# Altium project SSL_Motherboard_2024.PrjPcb
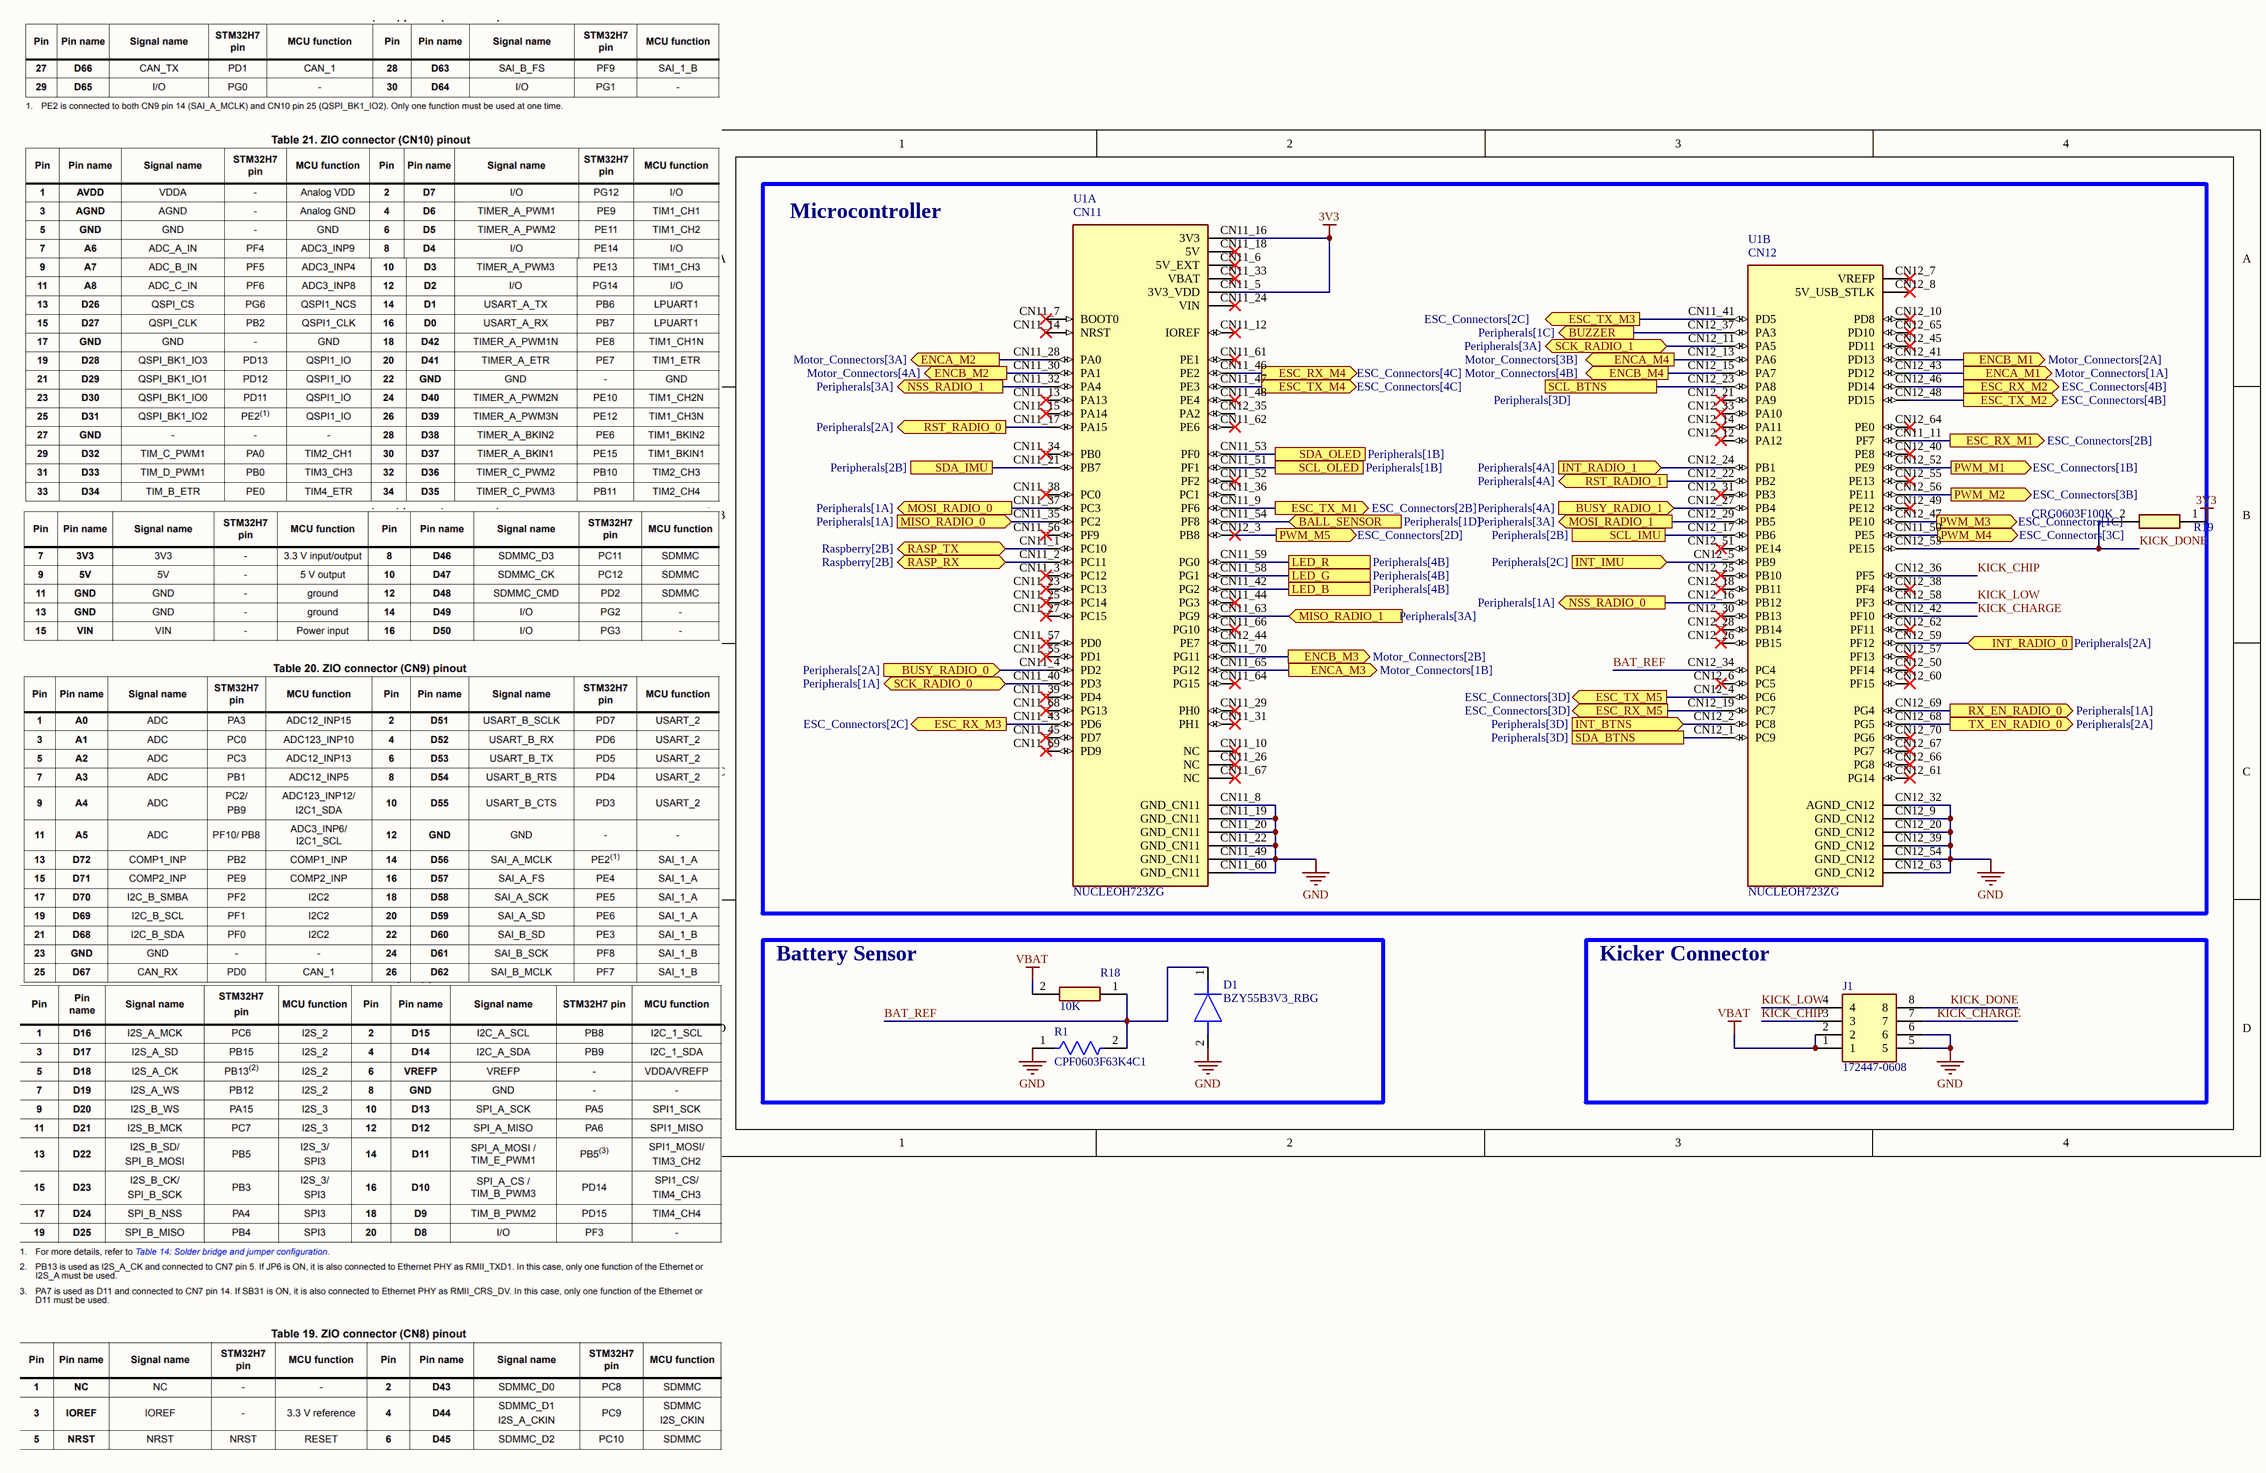
[diagram p0: Main.SchDoc]
6 sheets, 75 parts. Net scope: flat (ports and power ports of the same name join across sheets).
Board file: MotherBoard.PcbDoc
Sheets:
  Main.SchDoc
  PowerSupply.SchDoc
  Peripherals.SchDoc
  Raspberry.SchDoc
  Motor_Connectors.SchDoc
  ESC_Connectors.SchDoc

## Sheet Main.SchDoc
size A4; SheetNumber: 1; SheetTotal: 6

### Parts
D1  BZY55B3V3_RBG  [BZY55B3V3RBG]
J1  172447-0608  [172447-YY08]
R1  CPF0603F63K4C1  [FP-CPF0603-MFG]
R18  10K  [RESC1608X55N]
R19  CRG0603F100K  [RESC1608X55N]
U1  NUCLEOH723ZG  [NEW_NUCLEO]  (parts A,B of 2)

### Blocks framed on the sheet
Microcontroller: R19 U1
Battery Sensor: D1 R1 R18
Kicker Connector: J1

### Ports
BALL_SENSOR (in, see Peripherals[1D]), BUSY_RADIO_0 (in, see Peripherals[2A]), BUSY_RADIO_1 (in, see Peripherals[4A]), BUZZER (out, see Peripherals[1C]), ENCA_M1 (out, see Motor_Connectors[1A]), ENCA_M2 (out, see Motor_Connectors[3A]), ENCA_M3 (out, see Motor_Connectors[1B]), ENCA_M4 (out, see Motor_Connectors[3B]), ENCB_M1 (out, see Motor_Connectors[2A]), ENCB_M2 (out, see Motor_Connectors[4A]), ENCB_M3 (out, see Motor_Connectors[2B]), ENCB_M4 (out, see Motor_Connectors[4B]), ESC_RX_M1 (out, see ESC_Connectors[2B]), ESC_RX_M2 (out, see ESC_Connectors[4B]), ESC_RX_M3 (out, see ESC_Connectors[2C]), ESC_RX_M4 (out, see ESC_Connectors[4C]), ESC_RX_M5 (out, see ESC_Connectors[3D]), ESC_TX_M1 (out, see ESC_Connectors[2B]), ESC_TX_M2 (out, see ESC_Connectors[4B]), ESC_TX_M3 (out, see ESC_Connectors[2C]), ESC_TX_M4 (out, see ESC_Connectors[4C]), ESC_TX_M5 (out, see ESC_Connectors[3D]), INT_BTNS (in, see Peripherals[3D]), INT_IMU (in, see Peripherals[2C]), INT_RADIO_0 (in, see Peripherals[2A]), INT_RADIO_1 (in, see Peripherals[4A]), LED_B (see Peripherals[4B]), LED_G (see Peripherals[4B]), LED_R (see Peripherals[4B]), MISO_RADIO_0 (in, see Peripherals[1A]), MISO_RADIO_1 (in, see Peripherals[3A]), MOSI_RADIO_0 (out, see Peripherals[1A]), MOSI_RADIO_1 (out, see Peripherals[3A]), NSS_RADIO_0 (out, see Peripherals[1A]), NSS_RADIO_1 (out, see Peripherals[3A]), PWM_M1 (out, see ESC_Connectors[1B]), PWM_M2 (out, see ESC_Connectors[3B]), PWM_M3 (out, see ESC_Connectors[1C]), PWM_M4 (out, see ESC_Connectors[3C]), PWM_M5 (out, see ESC_Connectors[2D]), RASP_RX (bidir, see Raspberry[2B]), RASP_TX (bidir, see Raspberry[2B]), RST_RADIO_0 (out, see Peripherals[2A]), RST_RADIO_1 (out, see Peripherals[4A]), RX_EN_RADIO_0 (out, see Peripherals[1A]), SCK_RADIO_0 (bidir, see Peripherals[1A]), SCK_RADIO_1 (bidir, see Peripherals[3A]), SCL_BTNS (see Peripherals[3D]), SCL_IMU (see Peripherals[2B]), SCL_OLED (see Peripherals[1B]), SDA_BTNS (see Peripherals[3D]), SDA_IMU (see Peripherals[2B]), SDA_OLED (see Peripherals[1B]), TX_EN_RADIO_0 (out, see Peripherals[2A])

### Nets
3V3: R19.1 U1.CN11_5(3V3_VDD) U1.CN11_16(3V3)
GND: D1.2(A) J1.5 J1.6 R1.1 U1.CN11_8(GND_CN11) U1.CN11_19(GND_CN11) U1.CN11_20(GND_CN11) U1.CN11_22(GND_CN11) U1.CN11_49(GND_CN11) U1.CN11_60(GND_CN11) U1.CN12_9(GND_CN12) U1.CN12_20(GND_CN12) U1.CN12_32(AGND_CN12) U1.CN12_39(GND_CN12) U1.CN12_54(GND_CN12) U1.CN12_63(GND_CN12)
VBAT: J1.1 J1.2 R18.2
BAT_REF: D1.1(K) R1.2 R18.1 U1.CN12_34(PC4)
KICK_CHARGE: J1.7 U1.CN12_42(PF10)
KICK_CHIP: J1.3 U1.CN12_36(PF5)
KICK_DONE: J1.8 R19.2 U1.CN12_53(PE15)
KICK_LOW: J1.4 U1.CN12_58(PF3)
NetIC3_4: U1.CN12_5(PB9) ; port INT_IMU
NetIC3_13: U1.CN12_17(PB6) ; port SCL_IMU
NetIC3_14: U1.CN11_21(PB7) ; port SDA_IMU
NetIC4_1: U1.CN12_2(PC8) ; port INT_BTNS
NetIC4_2: U1.CN12_23(PA8) ; port SCL_BTNS
NetIC4_4: U1.CN12_1(PC9) ; port SDA_BTNS
NetJ2_2: U1.CN11_54(PF8) ; port BALL_SENSOR
NetJ4_32: U1.CN11_2(PC11) ; port RASP_RX
NetJ4_34: U1.CN11_1(PC10) ; port RASP_TX
NetJ6_2: U1.CN12_41(PD13) ; port ENCB_M1
NetJ6_7: U1.CN12_43(PD12) ; port ENCA_M1
NetJ7_2: U1.CN11_70(PG11) ; port ENCB_M3
NetJ7_7: U1.CN11_65(PG12) ; port ENCA_M3
NetJ8_2: U1.CN11_30(PA1) ; port ENCB_M2
NetJ8_7: U1.CN11_28(PA0) ; port ENCA_M2
NetJ10_2: U1.CN12_15(PA7) ; port ENCB_M4
NetJ10_7: U1.CN12_13(PA6) ; port ENCA_M4
NetJ16_01: U1.CN12_52(PE9) ; port PWM_M1
NetJ16_02: U1.CN11_9(PF6) ; port ESC_TX_M1
NetJ16_04: U1.CN11_11(PF7) ; port ESC_RX_M1
NetJ17_01: U1.CN12_47(PE10) ; port PWM_M3
NetJ17_02: U1.CN11_41(PD5) ; port ESC_TX_M3
NetJ17_04: U1.CN11_43(PD6) ; port ESC_RX_M3
NetJ19_01: U1.CN12_3(PB8) ; port PWM_M5
NetJ19_02: U1.CN12_4(PC6) ; port ESC_TX_M5
NetJ19_04: U1.CN12_19(PC7) ; port ESC_RX_M5
NetJ22_01: U1.CN12_56(PE11) ; port PWM_M2
NetJ22_02: U1.CN12_48(PD15) ; port ESC_TX_M2
NetJ22_04: U1.CN12_46(PD14) ; port ESC_RX_M2
NetJ23_01: U1.CN11_50(PE5) ; port PWM_M4
NetJ23_02: U1.CN11_47(PE3) ; port ESC_TX_M4
NetJ23_04: U1.CN11_46(PE2) ; port ESC_RX_M4
NetMD1_3: U1.CN11_35(PC2) ; port MISO_RADIO_0
NetMD1_4: U1.CN11_37(PC3) ; port MOSI_RADIO_0
NetMD1_5: U1.CN11_40(PD3) ; port SCK_RADIO_0
NetMD1_6: U1.CN12_16(PB12) ; port NSS_RADIO_0
NetMD1_8: U1.CN12_69(PG4) ; port RX_EN_RADIO_0
NetMD1_9: U1.CN12_68(PG5) ; port TX_EN_RADIO_0
NetMD1_11: U1.CN11_17(PA15) ; port RST_RADIO_0
NetMD1_12: U1.CN11_4(PD2) ; port BUSY_RADIO_0
NetMD1_13: U1.CN12_59(PF12) ; port INT_RADIO_0
NetMD2_3: U1.CN11_63(PG9) ; port MISO_RADIO_1
NetMD2_4: U1.CN12_29(PB5) ; port MOSI_RADIO_1
NetMD2_5: U1.CN12_11(PA5) ; port SCK_RADIO_1
NetMD2_6: U1.CN11_32(PA4) ; port NSS_RADIO_1
NetMD2_11: U1.CN12_22(PB2) ; port RST_RADIO_1
NetMD2_12: U1.CN12_27(PB4) ; port BUSY_RADIO_1
NetMD2_13: U1.CN12_24(PB1) ; port INT_RADIO_1
NetP1_3: U1.CN11_51(PF1) ; port SCL_OLED
NetP1_4: U1.CN11_53(PF0) ; port SDA_OLED
NetR10_1: U1.CN12_37(PA3) ; port BUZZER
NetR21_2: U1.CN11_42(PG2) ; port LED_B
NetR22_2: U1.CN11_59(PG0) ; port LED_R
NetR23_2: U1.CN11_58(PG1) ; port LED_G

Not connected (* = marked no-connect by the designer): U1 CN11_3(PC12)* CN11_6(5V_EXT)* CN11_7(BOOT0)* CN11_10(NC)* CN11_12(IOREF)* CN11_13(PA13)* CN11_14(NRST)* CN11_15(PA14)* CN11_18(5V)* CN11_23(PC13)* CN11_24(VIN)* CN11_25(PC14)* CN11_26(NC)* CN11_27(PC15)* CN11_29(PH0)* CN11_31(PH1)* CN11_33(VBAT)* CN11_34(PB0)* CN11_36(PC1) CN11_38(PC0)* CN11_39(PD4)* CN11_44(PG3)* CN11_45(PD7)* CN11_48(PE4)* CN11_52(PF2)* CN11_55(PD1)* CN11_56(PF9)* CN11_57(PD0)* CN11_61(PE1)* CN11_62(PE6)* CN11_64(PG15)* CN11_66(PG10)* CN11_67(NC)* CN11_68(PG13)* CN11_69(PD9)* CN12_6(PC5)* CN12_7(VREFP)* CN12_8(5V_USB_STLK)* CN12_10(PD8)* CN12_12(PA12)* CN12_14(PA11)* CN12_18(PB11)* CN12_21(PA9)* CN12_25(PB10)* CN12_26(PB15)* CN12_28(PB14)* CN12_30(PB13)* CN12_31(PB3)* CN12_33(PA10)* CN12_35(PA2) CN12_38(PF4)* CN12_40(PE8)* CN12_44(PE7) CN12_45(PD11)* CN12_49(PE12)* CN12_50(PF14)* CN12_51(PE14)* CN12_55(PE13)* CN12_57(PF13)* CN12_60(PF15)* CN12_61(PG14)* CN12_62(PF11)* CN12_64(PE0)* CN12_65(PD10)* CN12_66(PG8)* CN12_67(PG7)* CN12_70(PG6)*

### Notes on the sheet
- (in symbol NUCLEOH723ZG, part A) CN11
- (in symbol NUCLEOH723ZG, part B) CN12

### Library data of the parts
D1 = BZY55B3V3_RBG: Diode; Manufacturer_Name: Taiwan Semiconductor; Manufacturer_Part_Number: BZY55B3V3 RBG; Datasheet Link: https://componentsearchengine.com/Datasheets/1/BZY55B3V3 RBG.pdf; Height: 0.85mm; Mouser Part Number: 821-BZY55B3V3RBG; Mouser Price/Stock: https://www.mouser.co.uk/ProductDetail/Taiwan-Semiconductor/BZY55B3V3-RBG?qs=mAH9sUMRCtvrJdI%2FtfeTug%3D%3D
J1 = 172447-0608: Connector; Manufacturer_Name: Molex; Datasheet Link: https://www.molex.com/pdm_docs/sd/1724470406_sd.pdf; Height: 12.8mm; Manufacturer_Part_Number: 172447-0608; Mouser Part Number: 538-172447-0608; Mouser Price/Stock: https://www.mouser.co.uk/ProductDetail/Molex/172447-0608?qs=t7xnP681wgUaroQMnMhOkA%3D%3D
R1 = CMP-03211-001472-1: RES SMD 63.4KΩ 1% 1/16W 0603; Manufacturer: TE Connectivity; Voltage Rating: 50V; Temperature Coefficient: 50ppm/°C; Power Rating: 0.063W; Composition: Thin Film; Octopart: https://octopart.com/cpf0603f63k4c1-te+connectivity-7515022; Temperature Range High: +155°C; Lead Free: Yes; Series: CPF; Resistance: 63.4KΩ; Height: 0.55mm; Package: CPF0603; Manufacturer Part Number: CPF0603F63K4C1; Temperature: -55°C to +155°C; Device Class L3: Chip SMD Resistors; Ipc Land Pattern Name: RESC15580X45; RoHS: TRUE; Category: Res; ComponentLink2URL: https://www.te.com/commerce/DocumentDelivery/DDEController?Action=showdoc&DocId=Data+Sheet%7F1773200%7FM%7Fpdf%7FEnglish%7FENG_DS_1773200_M.pdf%7F3-1676481-2; Value: 63.4KΩ; packaging: 1k Reel; Tolerance: 1%; Automotive: No; Device Class L2: Resistors; Device Class L1: Passive Components; Temperature Range Low: -55°C; ComponentLink2Description: Datasheet; octopart_url: https://octopart.com/cpf0603f63k4c1-te+connectivity-7515022
R18 = ERJ-U3RD1002V: Resistor; Manufacturer_Name: Panasonic; Datasheet Link: https://industrial.panasonic.com/cdbs/www-data/pdf/RDP0000/RDP0000C343.pdf; Height: 0.55mm; Manufacturer_Part_Number: ERJ-U3RD1002V; Mouser Part Number: 667-ERJ-U3RD1002V; Mouser Price/Stock: https://www.mouser.co.uk/ProductDetail/Panasonic/ERJ-U3RD1002V?qs=TiOZkKH1s2Rg0qUjKdWcPw%3D%3D; Arrow Part Number: ERJ-U3RD1002V; Arrow Price/Stock: https://www.arrow.com/en/products/erj-u3rd1002v/panasonic?region=nac
R19 = CRG0603F100K: Resistor; Manufacturer_Name: TE Connectivity; Datasheet Link: http://docs-europe.electrocomponents.com/webdocs/13d1/0900766b813d116f.pdf; Height: 0.55mm; Manufacturer_Part_Number: CRG0603F100K; Mouser Part Number: 279-CRG0603F100K; Mouser Price/Stock: https://www.mouser.co.uk/ProductDetail/TE-Connectivity-Holsworthy/CRG0603F100K?qs=VHcS2MTj4gaG9fI5w0o7FA%3D%3D; Arrow Part Number: CRG0603F100K; Arrow Price/Stock: https://www.arrow.com/en/products/crg0603f100k/te-connectivity?region=nac
U1 = NUCLEOH723ZG: STM32H723ZG Nucleo-144 STM32H7 STM32 MCU 32-Bit Embedded Evaluation Board; MF: STMicroelectronics; Value: *; Purchase-URL: https://pricing.snapeda.com/search/part/NUCLEOH723ZG/?ref=eda; Package: None; Check_prices: https://www.snapeda.com/parts/NUCLEOH723ZG/STMicroelectronics/view-part/?ref=eda; MP: NUCLEOH723ZG; Price: None; SnapEDA_Link: https://www.snapeda.com/parts/NUCLEOH723ZG/STMicroelectronics/view-part/?ref=snap; Availability: In Stock

## Sheet PowerSupply.SchDoc
size A4; SheetNumber: 2; SheetTotal: 6
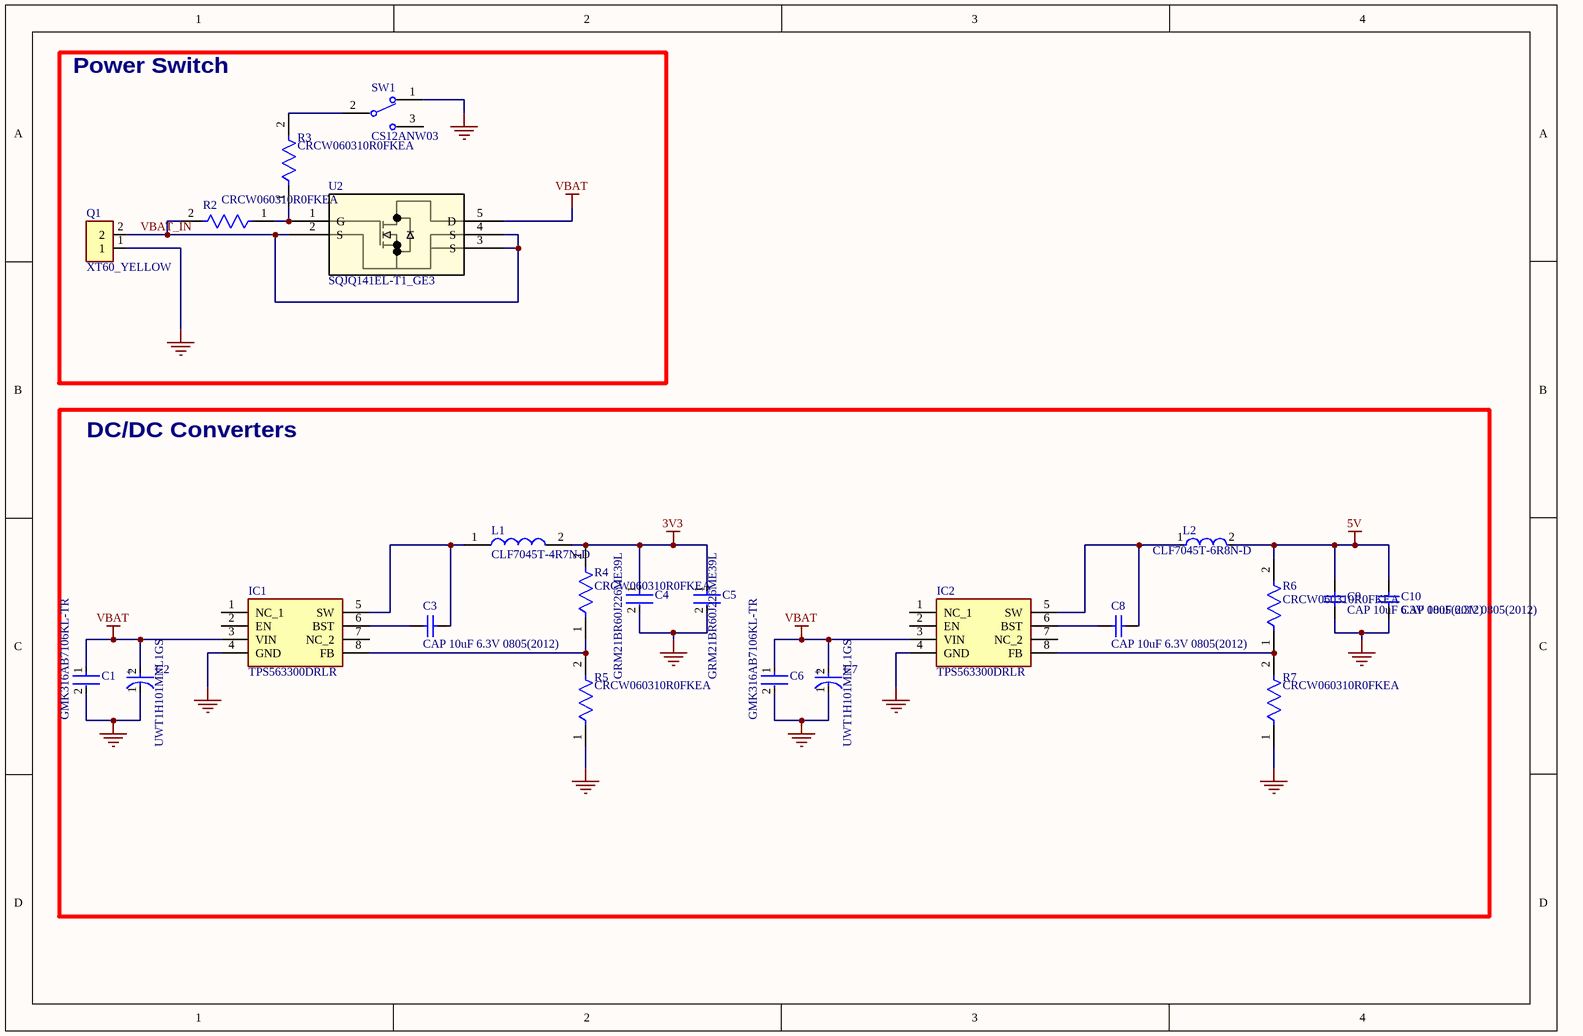
[diagram p1: PowerSupply.SchDoc]

### Parts
C1  GMK316AB7106KL-TR  [FP-1206-L_3_2_0_2-W_1_6_0-IPC_C]
C2  UWT1H101MNL1GS  [FP-UWT1H101MNL1GS-MFG]
C3  CAP 10uF 6.3V 0805(2012)  [CAPC0805(2012)155_L]
C4  GRM21BR60J226ME39L  [FP-GRM21B-0_15-MFG]
C5  GRM21BR60J226ME39L  [FP-GRM21B-0_15-MFG]
C6  GMK316AB7106KL-TR  [FP-1206-L_3_2_0_2-W_1_6_0-IPC_C]
C7  UWT1H101MNL1GS  [FP-UWT1H101MNL1GS-MFG]
C8  CAP 10uF 6.3V 0805(2012)  [CAPC0805(2012)155_L]
C9  CAP 10uF 6.3V 0805(2012)  [CAPC0805(2012)155_L]
C10  CAP 10uF 6.3V 0805(2012)  [CAPC0805(2012)155_L]
IC1  TPS563300DRLR  [SOTFL50P160X60-8N]
IC2  TPS563300DRLR  [SOTFL50P160X60-8N]
L1  CLF7045T-4R7N-D  [CLF7045-D]
L2  CLF7045T-6R8N-D  [FP-CLF7045-MFG]
Q1  XT60_YELLOW  [AMASS_XT60PB-M]
R2  CRCW060310R0FKEA  [FP-CRCW0603-e3-IPC_A]
R3  CRCW060310R0FKEA  [FP-CRCW0603-e3-IPC_A]
R4  CRCW060310R0FKEA  [FP-CRCW0603-e3-IPC_A]
R5  CRCW060310R0FKEA  [FP-CRCW0603-e3-IPC_A]
R6  CRCW060310R0FKEA  [FP-CRCW0603-e3-IPC_A]
R7  CRCW060310R0FKEA  [FP-CRCW0603-e3-IPC_A]
SW1  CS12ANW03  [FP-CS12ANW03-MFG]
U2  SQJQ141EL-T1_GE3  [PowerPAK_8x8L_BWL-2_VIS]

### Blocks framed on the sheet
Power Switch: Q1 R2 R3 SW1 U2
DC/DC Converters: C1-C10 IC1 IC2 L1 L2 R4-R7

### Nets
3V3: C4.1 C5.1 L1.2 R4.2
5V: C9.2 C10.2 L2.2 R6.2
GND: C1.2 C2.1(C) C4.2 C5.2 C6.2 C7.1(C) C9.1 C10.1 IC1.4(GND) IC2.4(GND) Q1.1 R5.1 R7.1 SW1.1
VBAT: C1.1 C2.2(A) C6.1 C7.2(A) IC1.3(VIN) IC2.3(VIN) U2.5(D)
VBAT_IN: Q1.2 R2.2 U2.2(S) U2.3(S) U2.4(S)
NetC3_1: C3.1 IC1.5(SW) L1.1
NetC3_2: C3.2 IC1.6(BST)
NetC8_1: C8.1 IC2.5(SW) L2.1
NetC8_2: C8.2 IC2.6(BST)
NetIC1_8: IC1.8(FB) R4.1 R5.2
NetIC2_8: IC2.8(FB) R6.1 R7.2
NetR2_1: R2.1 R3.1 U2.1(G)
NetR3_2: R3.2 SW1.2(2(COM))

Not connected (* = marked no-connect by the designer): IC1 1(NC_1) 2(EN) 7(NC_2); IC2 1(NC_1) 2(EN) 7(NC_2); SW1 3

### Notes on the sheet
- (in symbol CMP-2000-07373-2) +

### Library data of the parts
C1 C6 = CMP-2000-06324-3: None; Voltage Rating (DC): 35V; Capacitance: 10uF; Tolerance: 10%; Dielectric: X7R; Thickness: 0.071inch; Mount: Surface Mount; Case Code (Imperial): 1206; RoHS Compliant: Yes; Voltage Rating: 35V; Case Code (Metric): 3216; Height: 1.6mm; Packaging: Tape and Reel; Resistor Type: Ceramic; REACH SVHC: No SVHC; Max Operating Temperature: 125°C; Termination: SMD/SMT; Package Quantity: 2000; Width: 1.6mm; Case/Package: 1206; Length: 0.126inch; Series: M; Min Operating Temperature: -55°C
C2 C7 = CMP-2000-07373-2: CAP ALUM 100UF 20% 50V SMD; Leakage Current: 3uA; Ripple Current: 140mA; Life (Hours): 1000Hour; Dissipation Factor: 0.14%; Dielectric Material: Aluminium; Termination: SMD/SMT; Tolerance: 20%; Package Quantity: 500; Capacitance: 100uF; Height: 10mm; REACH SVHC: No SVHC; Case/Package: Radial; Series: WT; Diameter: 8mm; Voltage Rating: 50V; Construction: Cylindrical; Length: 10mm; Min Operating Temperature: -55°C; Max Operating Temperature: 105°C; Voltage Rating (DC): 50V; Packaging: Tape and Reel; Voltage: 50V; Mount: Surface Mount; Ripple Current (AC): 140mA; Radiation Hardening: No; Number of Pins: 2; Lead Free: Lead Free; Height - Seated (Max): 0.413inch; RoHS Compliant: Yes
C3 C8-C10 = CMP-1036-04916-1: CAP 10uF 6.3V ±10% 0805 (2012 Metric) Thickness 1.55mm SMD; Tolerance: Â±10%; Case-Metric: 2012; Case-EIA: 0805; Rated Voltage: 6.3 V; Technology: SMT; Value: 10uF; Max Thickness: 1.55 mm
C4 C5 = CMP-2007-03385-2: Chip Multilayer Ceramic Capacitors for General Purpose, 0805, 22uF, X5R, 15%, 20%, 6.3V; Material: Ceramic; Max Operating Temperature: 85°C; Voltage: 6.3V; Min Operating Temperature: -55°C; Case/Package: 0805; Thickness: 0.053inch; Dielectric: X5R; Packaging: Tape and Reel; Depth: 1.25mm; Termination: SMD/SMT; Voltage Rating (DC): 6.3V; Radiation Hardening: No; Tolerance: 20%; Mount: Surface Mount; Lead Free: Lead Free; Package Quantity: 1; REACH SVHC: No SVHC; Voltage Rating: 6.3V; Capacitance: 22uF; Length: 2mm; Case Code (Imperial): 0805; Case Code (Metric): 2012; Width: 0.049inch; Height: 1.25mm
IC1 IC2 = TPS563300DRLR: Integrated Circuit; Manufacturer_Name: Texas Instruments; Datasheet Link: https://www.ti.com/lit/ds/symlink/tps563300.pdf?ts=1666035990155&ref_url=https%253A%252F%252Fwww.ti.com%252Fproduct%252FTPS563300; Height: 0.6mm; Manufacturer_Part_Number: TPS563300DRLR; Mouser Part Number: 595-TPS563300DRLR; Mouser Price/Stock: https://www.mouser.co.uk/ProductDetail/Texas-Instruments/TPS563300DRLR?qs=vvQtp7zwQdMDxJAw0dSlAg%3D%3D
L1 = CLF7045T-4R7N-D: Inductor; Manufacturer_Name: TDK; Datasheet Link: https://product.tdk.com/system/files/dam/doc/product/inductor/inductor/smd/wdcatalog/withdrawn_inductor_commercial_power_clf7045_en.pdf; Height: 4.8mm; Manufacturer_Part_Number: CLF7045T-4R7N-D; Mouser Part Number: 810-CLF7045T-4R7N-D; Mouser Price/Stock: https://www.mouser.co.uk/ProductDetail/TDK/CLF7045T-4R7N-D?qs=ilIqL0%2F%2FoDU8gjMEHwFGUQ%3D%3D; Arrow Part Number: CLF7045T-4R7N-D; Arrow Price/Stock: https://www.arrow.com/en/products/clf7045t-4r7n-d/tdk
L2 = CMP-08253-000023-1: FIXED IND 6.8UH 3A 27 MOHM SMD; Manufacturer: TDK; Test Frequency: 100kHz; Tolerance: 30%; Core Material: Ferrite; Automotive Grade: Grade 0; Shielding: true; Series Resistance: 35.1mΩ; ComponentLink2Description: Datasheet; Inductance: 6.8uH; Lead Free: Yes; Device Class L3: Fixed Inductors; Rms Current: 3A; Package: CLF7045; Manufacturer Part Number: CLF7045T-6R8N-D; Digikey Description: FIXED IND 6.8UH 3A 27 MOHM SMD; Temperature Range Low: -40°C; ComponentLink2URL: https://product.tdk.com/en/search/inductor/inductor/smd/info/print_pdf; Temperature Range High: +150°C; Device Class L1: Passive Components; Device Class L2: Inductors; Composition: Wirewound; Height: 4.8mm; RoHS: TRUE; Mouser Description: Inductor Power Shielded Wirewound 6.8uH 30% 100KHz Ferrite 3A 35.1mOhm DCR Automotive T/R; Value: 6.8uH; Octopart: https://octopart.com/clf7045t-6r8n-d-tdk-27590387; Temperature: -40°C to +150°C; Automotive: Yes; Category: Ind
Q1 = XT60_YELLOW: Power connector; 65A; PIN: 2; Colour: yellow; MP: XT60 YELLOW; MF: Pololu; SnapEDA_Link: https://www.snapeda.com/parts/XT60%20YELLOW/Pololu/view-part/?ref=snap; Availability: Not in stock; Package: None; Check_prices: https://www.snapeda.com/parts/XT60%20YELLOW/Pololu/view-part/?ref=eda; Value: *; Price: None
R2-R7 = CMP-2000-03845-2: RES Thick Film, 10Ω, 1%, 0.1W, 100ppm/°C, 0603; Resistance: 10R; Voltage Rating (DC): 75V; Power Rating: 100mW; Depth: 0.85mm; Height: 0.45mm; Package Quantity: 10; Temperature Coefficient: 100ppm/°C; Weight: 7.1E-05oz; Case Code (Metric): 1608; Number of Terminations: 2; Features: Automotive AEC-Q200; Termination: SMD/SMT; Lead Free: Lead Free; Mount: Surface Mount; Number of Pins: 2; Tolerance: 1%; Max Power Dissipation: 100mW; Width: 0.033inch; Contact Plating: Tin; Case Code (Imperial): 0603; Max Operating Temperature: 155°C; Min Operating Temperature: -55°C; Voltage Rating: 75V; Length: 1.55mm; Case/Package: 0603; Composition: Thick Film; Packaging: Tape and Reel; Military Standard: Not
SW1 = CMP-31746-000002-1: SWITCH SLIDE SPDT 3A 125V; Max Voltage Rating (AC): 250V; Mechanical Life: 50000Cycles; Switch Travel: 2.2mm; Electrical Life: 20000Cycles; Actuator Length: 5.1mm; Illumination Type: Non-Illuminated; Contact Style: Non-Shorting; Actuator Type: Standard; Actuator Material: Nylon; Switch Function: On-On; Max Operating Temperature: 85°C; Series: CS; Contact Current Rating: 3A; Min Operating Temperature: -30°C; Current Rating: 3A; Mount: Through Hole; Depth: 7.5mm; RoHS Compliant: Yes; Throw Configuration: SPDT; Lead Free: Lead Free; Orientation: Vertical; Contact Plating: Silver; Reach SVHC Compliant: Yes; Termination: PC Pin; Max Current Rating: 3A; Packaging: Tray; Length: 14mm; Package Quantity: 1; Primary Type: SWITCH; Flammability Rating: UL94 V-0; Contact Material: Copper; Voltage Rating (AC): 125V
U2 = SQJQ141EL-T1_GE3: No Description Available; Mfr_Name: Vishay; Copyright: Copyright (C) 2023 Ultra Librarian. All rights reserved.; Manufacturer_Part_Number: SQJQ141EL-T1_GE3; RefDes: RefDes; Type: DEV

## Sheet Peripherals.SchDoc
size A4; SheetNumber: 3; SheetTotal: 6
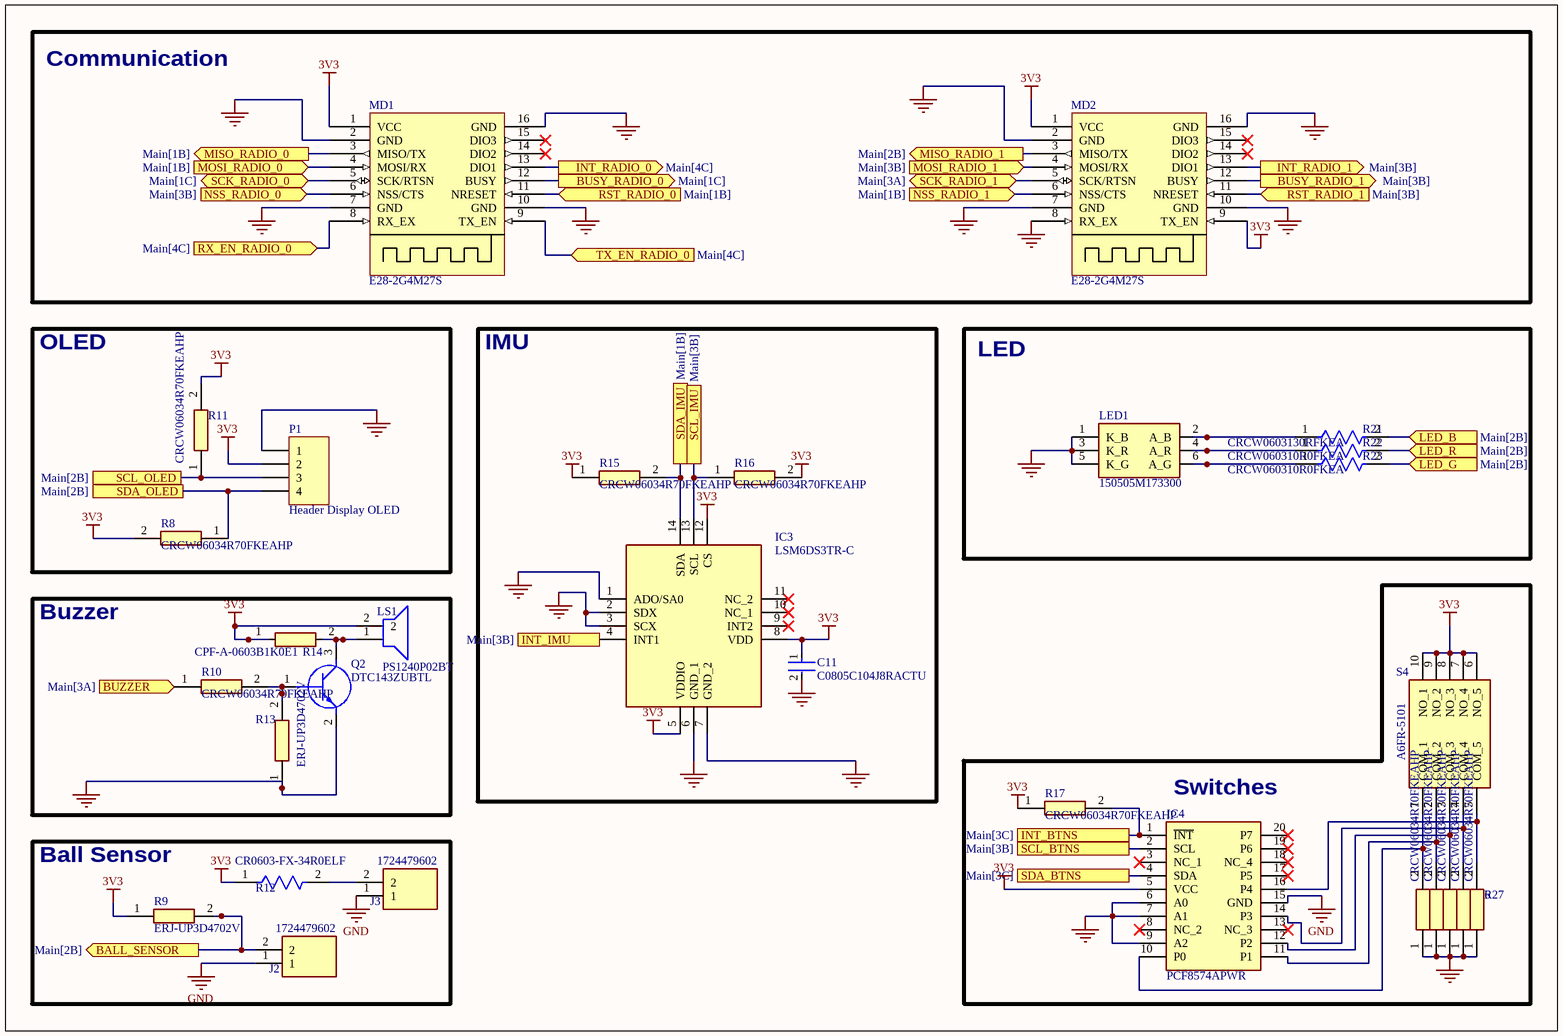
[diagram p2: Peripherals.SchDoc]

### Parts
C11  C0805C104J8RACTU  [FP-C0805C-DN-MFG]
IC3  LSM6DS3TR-C  [LGA-14(2.5X3X0.86)]
IC4  PCF8574APWR  [SOP65P640X120-20N]
J2  1724479602  [172447_94959697_02]
J3  1724479602  [172447_94959697_02]
LED1  150505M173300  [150505M173300]
LS1  PS1240P02BT  [PS1240P02BT]
MD1  E28-2G4M27S  [E28-2G4M27S]
MD2  E28-2G4M27S  [E28-2G4M27S]
P1  Header Display OLED  [OLED]
Q2  DTC143ZUBTL  [SOTFL65P210X105-3N]
R8  CRCW06034R70FKEAHP  [RESC1608X55N]
R9  ERJ-UP3D4702V  [ERJUP3]
R10  CRCW06034R70FKEAHP  [RESC1608X55N]
R11  CRCW06034R70FKEAHP  [RESC1608X55N]
R12  CR0603-FX-34R0ELF  [FP-CR0603-MFG]
R13  ERJ-UP3D4702V  [ERJUP3]
R14  CPF-A-0603B1K0E1  [RESC1608X55N]
R15  CRCW06034R70FKEAHP  [RESC1608X55N]
R16  CRCW06034R70FKEAHP  [RESC1608X55N]
R17  CRCW06034R70FKEAHP  [RESC1608X55N]
R20  CRCW06034R70FKEAHP  [RESC1608X55N]
R21  CRCW0603130RFKEA  [FP-CRCW0603-e3-IPC_A]
R22  CRCW060310R0FKEA  [FP-CRCW0603-e3-IPC_A]
R23  CRCW060310R0FKEA  [FP-CRCW0603-e3-IPC_A]
R24  CRCW06034R70FKEAHP  [RESC1608X55N]
R25  CRCW06034R70FKEAHP  [RESC1608X55N]
R26  CRCW06034R70FKEAHP  [RESC1608X55N]
R27  CRCW06034R70FKEAHP  [RESC1608X55N]
S4  A6FR-5101  [A6FR5101]

### Blocks framed on the sheet
Communication: MD1 MD2
OLED: P1 R8 R11
IMU: C11 IC3 R15 R16
LED: LED1 R21-R23
Buzzer: LS1 Q2 R10 R13 R14
Switches: IC4 R17 R20 R24-R27 S4
Ball Sensor: J2 J3 R9 R12

### Ports
BALL_SENSOR (out, see Main[2B]), BUSY_RADIO_0 (out, see Main[1C]), BUSY_RADIO_1 (out, see Main[3B]), BUZZER (in, see Main[3A]), INT_BTNS (see Main[3C]), INT_IMU (out, see Main[3B]), INT_RADIO_0 (out, see Main[4C]), INT_RADIO_1 (out, see Main[3B]), LED_B (in, see Main[2B]), LED_G (in, see Main[2B]), LED_R (in, see Main[2B]), MISO_RADIO_0 (out, see Main[1B]), MISO_RADIO_1 (out, see Main[2B]), MOSI_RADIO_0 (in, see Main[1B]), MOSI_RADIO_1 (in, see Main[3B]), NSS_RADIO_0 (in, see Main[3B]), NSS_RADIO_1 (in, see Main[1B]), RST_RADIO_0 (in, see Main[1B]), RST_RADIO_1 (in, see Main[3B]), RX_EN_RADIO_0 (in, see Main[4C]), SCK_RADIO_0 (bidir, see Main[1C]), SCK_RADIO_1 (bidir, see Main[3A]), SCL_BTNS (see Main[3B]), SCL_IMU (see Main[3B]), SCL_OLED (see Main[2B]), SDA_BTNS (see Main[3C]), SDA_IMU (see Main[1B]), SDA_OLED (see Main[2B]), TX_EN_RADIO_0 (in, see Main[4C])

### Nets
3V3: C11.1 IC3.5(VDDIO) IC3.8(VDD) IC3.12(CS) IC4.5(VCC) LS1.2 MD1.1(VCC) MD2.1(VCC) MD2.9(TX_EN) P1.2 R8.2 R9.1 R11.2 R12.1 R14.1 R15.1 R16.2 R17.1 S4.6(NO_5) S4.7(NO_4) S4.8(NO_3) S4.9(NO_2) S4.10(NO_1)
GND: C11.2 IC3.1(ADO/SA0) IC3.2(SDX) IC3.3(SCX) IC3.6(GND_1) IC3.7(GND_2) IC4.6(A0) IC4.7(A1) IC4.9(A2) IC4.15(GND) J2.1 J3.1 LED1.1(K_B) LED1.3(K_R) LED1.5(K_G) MD1.2(GND) MD1.7(GND) MD1.10(GND) MD1.16(GND) MD2.2(GND) MD2.7(GND) MD2.8(RX_EX) MD2.10(GND) MD2.16(GND) P1.1 Q2.2(E) R13.1 R20.1 R24.1 R25.1 R26.1 R27.1
NetIC3_4: IC3.4(INT1) ; port INT_IMU
NetIC3_13: IC3.13(SCL) R16.1 ; port SCL_IMU
NetIC3_14: IC3.14(SDA) R15.2 ; port SDA_IMU
NetIC4_1: IC4.1(~{INT}) R17.2 ; port INT_BTNS
NetIC4_2: IC4.2(SCL) ; port SCL_BTNS
NetIC4_4: IC4.4(SDA) ; port SDA_BTNS
NetIC4_10: IC4.10(P0) R20.2 S4.1(COM_1)
NetIC4_11: IC4.11(P1) R24.2 S4.2(COM_2)
NetIC4_12: IC4.12(P2) R25.2 S4.3(COM_3)
NetIC4_14: IC4.14(P3) R26.2 S4.4(COM_4)
NetIC4_16: IC4.16(P4) R27.2 S4.5(COM_5)
NetJ2_2: J2.2 R9.2 ; port BALL_SENSOR
NetJ3_2: J3.2 R12.2
NetLED1_2: LED1.2(A_B) R21.1
NetLED1_4: LED1.4(A_R) R22.1
NetLED1_6: LED1.6(A_G) R23.1
NetLS1_1: LS1.1 Q2.3(C) R14.2
NetMD1_3: MD1.3(MISO/TX) ; port MISO_RADIO_0
NetMD1_4: MD1.4(MOSI/RX) ; port MOSI_RADIO_0
NetMD1_5: MD1.5(SCK/RTSN) ; port SCK_RADIO_0
NetMD1_6: MD1.6(NSS/CTS) ; port NSS_RADIO_0
NetMD1_8: MD1.8(RX_EX) ; port RX_EN_RADIO_0
NetMD1_9: MD1.9(TX_EN) ; port TX_EN_RADIO_0
NetMD1_11: MD1.11(NRESET) ; port RST_RADIO_0
NetMD1_12: MD1.12(BUSY) ; port BUSY_RADIO_0
NetMD1_13: MD1.13(DIO1) ; port INT_RADIO_0
NetMD2_3: MD2.3(MISO/TX) ; port MISO_RADIO_1
NetMD2_4: MD2.4(MOSI/RX) ; port MOSI_RADIO_1
NetMD2_5: MD2.5(SCK/RTSN) ; port SCK_RADIO_1
NetMD2_6: MD2.6(NSS/CTS) ; port NSS_RADIO_1
NetMD2_11: MD2.11(NRESET) ; port RST_RADIO_1
NetMD2_12: MD2.12(BUSY) ; port BUSY_RADIO_1
NetMD2_13: MD2.13(DIO1) ; port INT_RADIO_1
NetP1_3: P1.3 R11.1 ; port SCL_OLED
NetP1_4: P1.4 R8.1 ; port SDA_OLED
NetQ2_1: Q2.1(B) R10.2 R13.2
NetR10_1: R10.1 ; port BUZZER
NetR21_2: R21.2 ; port LED_B
NetR22_2: R22.2 ; port LED_R
NetR23_2: R23.2 ; port LED_G

Not connected (* = marked no-connect by the designer): IC3 9(INT2)* 10(NC_1)* 11(NC_2)*; IC4 3(NC_1)* 8(NC_2)* 13(NC_3)* 17(P5)* 18(NC_4)* 19(P6)* 20(P7)*; MD1 14(DIO2)* 15(DIO3)*; MD2 14(DIO2)* 15(DIO3)*

### Library data of the parts
C11 = CMP-03020-032188-1: CAP CER 0.1UF 10V 5% X7R 0805; Manufacturer: KEMET; Material: Ceramic; Tolerance: 0.05; Capacitance: 0.10 μF; Temperature Coefficient: 30ppm/°C; Value: 0.10 μF; Package: C0805C-DN; Device Class L1: Passive Components; Temperature: -55°C to +125°C; Category: Cap; RoHS: TRUE; Mouser Description: Multilayer Ceramic Capacitors MLCC - SMD/SMT 10volts 0.1uF X7R 5%; Lead Free: Yes; Temperature Range Low: -55°C; Temperature Range High: +125°C; Device Class L2: Capacitors; Temperature Characteristic: X7R; Device Class L3: Ceramic Capacitors; ComponentLink2Description: Datasheet; Automotive: No; Ipc Land Pattern Name: CAPC200125X78; Manufacturer Part Number: C0805C104J8RACTU; Voltage Rating: 10 V; Height: 0.88mm; Digikey Description: CAP CER 0.1UF 10V 5% X7R 0805; Octopart: https://octopart.com/c0805c104j8ractu-kemet-11807087; ComponentLink2URL: https://content.kemet.com/datasheets/KEM_C1003_C0G_SMD.pdf
IC3 = LSM6DS3TR-C: Integrated Circuit; Manufacturer_Name: STMicroelectronics; Datasheet Link: http://www.st.com/resource/en/datasheet/lsm6ds3tr-c.pdf; Manufacturer_Part_Number: LSM6DS3TR-C; Mouser Part Number: 511-LSM6DS3TR-C; Mouser Price/Stock: https://www.mouser.co.uk/ProductDetail/STMicroelectronics/LSM6DS3TR-C?qs=u4fy%2FsgLU9NHwPlhP3LTBw%3D%3D; Arrow Part Number: LSM6DS3TR-C; Arrow Price/Stock: https://www.arrow.com/en/products/lsm6ds3tr-c/stmicroelectronics?region=nac
IC4 = PCF8574APWR: Integrated Circuit; Manufacturer_Name: Texas Instruments; Datasheet Link: http://www.ti.com/lit/ds/symlink/pcf8574a.pdf; Height: 1.2mm; Manufacturer_Part_Number: PCF8574APWR; Mouser Part Number: 595-PCF8574APWR; Mouser Price/Stock: https://www.mouser.co.uk/ProductDetail/Texas-Instruments/PCF8574APWR?qs=bkMXpVdiF42gbWVI8U3xeA%3D%3D; Arrow Part Number: PCF8574APWR; Arrow Price/Stock: https://www.arrow.com/en/products/pcf8574apwr/texas-instruments?region=nac
J2 J3 = 1724479602: Connector; Manufacturer_Name: Molex; Datasheet Link: https://www.molex.com/pdm_docs/sd/1724470402_sd.pdf; Height: 12.8mm; Manufacturer_Part_Number: 1724479602
LED1 = 150505M173300: LED; Manufacturer_Name: Wurth Elektronik; Datasheet Link: https://katalog.we-online.de/led/datasheet/150505M173300.pdf; Height: 1.8mm; Manufacturer_Part_Number: 150505M173300; Mouser Part Number: 710-150505M173300; Mouser Price/Stock: https://www.mouser.co.uk/ProductDetail/Wurth-Elektronik/150505M173300?qs=fAHHVMwC%252Bbi%2FURn4Qu0%2FAA%3D%3D
LS1 = PS1240P02BT: Loudspeaker or Buzzer; Manufacturer_Name: TDK; Datasheet Link: https://product.tdk.com/system/files/dam/doc/product/sw_piezo/sw_piezo/piezo-buzzer/catalog/piezoelectronic_buzzer_ps_en.pdf; Manufacturer_Part_Number: PS1240P02BT; Mouser Part Number: 810-PS1240P02BT; Mouser Price/Stock: https://www.mouser.co.uk/ProductDetail/TDK/PS1240P02BT?qs=d7g9p1yFhWaZXSY9MjKMkw%3D%3D; Arrow Part Number: PS1240P02BT; Arrow Price/Stock: https://www.arrow.com/en/products/ps1240p02bt/tdk?region=nac
MD1 MD2 = E28-2G4M27S: E28-2G4M27S Ebyte SX1280 Module
P1 = Header Display OLED: Header, 4-Pin; LatestRevisionDate: 17-Jul-2002; LatestRevisionNote: Re-released for DXP Platform.; Publisher: Altium Limited
Q2 = DTC143ZUBTL: Transistor BJT NPN; Manufacturer_Name: ROHM Semiconductor; Datasheet Link: https://componentsearchengine.com/Datasheets/2/DTC143ZUBTL.pdf; Height: 1.05mm; Manufacturer_Part_Number: DTC143ZUBTL; Mouser Part Number: 755-DTC143ZUBTL; Mouser Price/Stock: https://www.mouser.co.uk/ProductDetail/ROHM-Semiconductor/DTC143ZUBTL?qs=IsRgwgmxh6%2Ffuj9yCN7zBQ%3D%3D
R8 R10 R11 R15-R17 R20 R24-R27 = CRCW06034R70FKEAHP: Resistor; Manufacturer_Name: Vishay; Datasheet Link: http://uk.rs-online.com/web/p/products/8206877; Height: 0.55mm; Manufacturer_Part_Number: CRCW06034R70FKEAHP; Mouser Part Number: 71-CRCW06034R70FKEAH; Mouser Price/Stock: https://www.mouser.co.uk/ProductDetail/Vishay-Dale/CRCW06034R70FKEAHP?qs=zlv9Rr0w%252BHo2DV5S%252Bz7lug%3D%3D; Arrow Part Number: CRCW06034R70FKEAHP; Arrow Price/Stock: https://www.arrow.com/en/products/crcw06034r70fkeahp/vishay?region=nac
R9 R13 = ERJ-UP3D4702V: Resistor; Manufacturer_Name: Panasonic; Datasheet Link: https://industrial.panasonic.com/cdbs/www-data/pdf/RDP0000/AOA0000C337.pdf; Height: 0.55mm; Manufacturer_Part_Number: ERJ-UP3D4702V; Mouser Part Number: 667-ERJ-UP3D4702V; Mouser Price/Stock: https://www.mouser.co.uk/ProductDetail/Panasonic/ERJ-UP3D4702V?qs=GedFDFLaBXG9rkg%252BckNv2g%3D%3D
R12 = CMP-1012-00343-2: Thick Film Chip Resistors 0603 34Ω 0.1W 1% 100ppm/°C; Resistance: 34R; Power Rating: 100mW; Voltage Rating: 50V; Military Standard: Not; Length: 1.6mm; Radiation Hardening: No; Temperature Coefficient: 100ppm/°C; Width: 0.8mm; Depth: 0.8mm; Case Code (Metric): 1608; Max Operating Temperature: 155°C; Tolerance: 1%; Weight: 7.1E-05oz; Contact Plating: Tin; Min Operating Temperature: -55°C; Height: 0.45mm; Mount: Surface Mount; Case Code (Imperial): 0603; Packaging: Tape and Reel; Composition: Thick Film; Termination: SMD/SMT; Case/Package: 0603; Thickness: 457um
R14 = CPF-A-0603B1K0E1: Resistor; Manufacturer_Name: TE Connectivity; Datasheet Link: https://componentsearchengine.com/Datasheets/2/CPF-A-0603B1K0E1.pdf; Height: 0.55mm; Manufacturer_Part_Number: CPF-A-0603B1K0E1; Mouser Part Number: 279-CPF-A-0603B1K0E1; Mouser Price/Stock: https://www.mouser.co.uk/ProductDetail/TE-Connectivity-Holsworthy/CPF-A-0603B1K0E1?qs=Rv6LVDxB0ZpCjx0kmO%252BiwA%3D%3D
R21 = CMP-2000-03889-2: RES Thick Film, 130Ω, 1%, 0.1W, 100ppm/°C, 0603; Working Voltage: 75V; Power Rating: 100mW; Resistance: 130R; Depth: 0.85mm; Max Operating Temperature: 155°C; Width: 0.85mm; Composition: Thick Film; Radiation Hardening: No; Contact Plating: Tin; Tolerance: 1%; Number of Pins: 2; Length: 1.55mm; Case/Package: 0603; Features: Automotive AEC-Q200; Case Code (Metric): 1608; Min Operating Temperature: -55°C; Package Quantity: 10; Temperature Coefficient: 100ppm/°C; Packaging: Tape and Reel; Lead Free: Lead Free; Number of Terminations: 2; Voltage Rating (DC): 75V; Termination: SMD/SMT; Height: 0.45mm; Military Standard: Not; Max Power Dissipation: 100mW; Voltage Rating: 75V; Weight: 7.1E-05oz; Case Code (Imperial): 0603
R22 R23 = CMP-2000-03845-2: as R2 on sheet PowerSupply; Depth: 0.85mm; Height: 0.45mm; Package Quantity: 10; Temperature Coefficient: 100ppm/°C; Weight: 7.1E-05oz; Case Code (Metric): 1608; Number of Terminations: 2; Features: Automotive AEC-Q200; Termination: SMD/SMT; Lead Free: Lead Free; Mount: Surface Mount; Number of Pins: 2; Tolerance: 1%; Max Power Dissipation: 100mW; Width: 0.033inch; Contact Plating: Tin; Case Code (Imperial): 0603; Max Operating Temperature: 155°C; Min Operating Temperature: -55°C; Voltage Rating: 75V; Length: 1.55mm; Case/Package: 0603; Composition: Thick Film; Packaging: Tape and Reel; Military Standard: Not
S4 = A6FR-5101: Switch; Manufacturer_Name: Omron Electronics; Datasheet Link: https://www.mouser.com/datasheet/2/307/omron_03202018_A6FR_datasheet-1314011.pdf; Height: 10.3mm; Manufacturer_Part_Number: A6FR-5101; Mouser Part Number: 653-A6FR-5101; Mouser Price/Stock: https://www.mouser.co.uk/ProductDetail/Omron-Electronics/A6FR-5101?qs=fAHHVMwC%252BbhmGWTU7%252Bb5wg%3D%3D; Arrow Part Number: A6FR-5101; Arrow Price/Stock: https://www.arrow.com/en/products/a6fr5101/omron?region=nac

## Sheet Raspberry.SchDoc
size A4; SheetNumber: 4; SheetTotal: 6
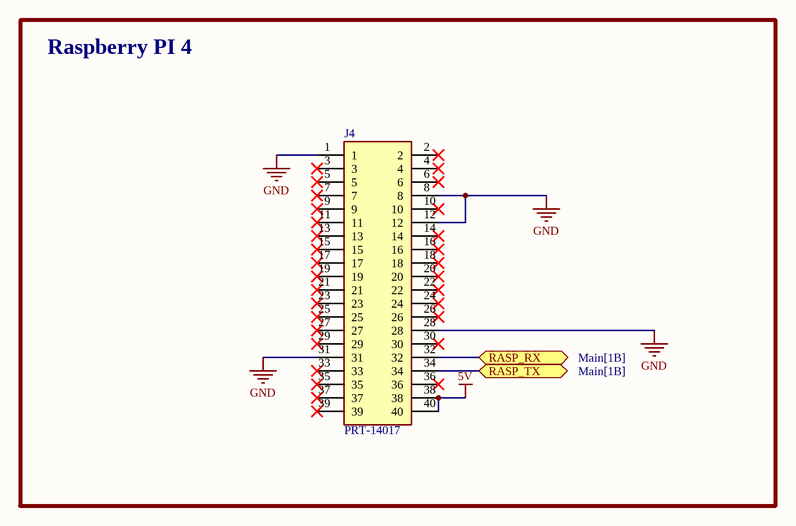
[diagram p3: Raspberry.SchDoc]

### Parts
J4  PRT-14017  [RHDR40W64P254_2X20_5130X500X1375P]

### Blocks framed on the sheet
Raspberry PI 4: J4

### Ports
RASP_RX (bidir, see Main[1B]), RASP_TX (bidir, see Main[1B])

### Nets
5V: J4.38 J4.40
GND: J4.1 J4.8 J4.12 J4.28 J4.31
NetJ4_32: J4.32 ; port RASP_RX
NetJ4_34: J4.34 ; port RASP_TX

Not connected (* = marked no-connect by the designer): J4 2* 3* 4* 5* 6* 7* 9* 10* 11* 13* 14* 15* 16* 17* 18* 19* 20* 21* 22* 23* 24* 25* 26* 27* 29* 30* 33* 35* 36* 37* 39*

### Library data of the parts
J4 = PRT-14017: Connector; Manufacturer_Name: SparkFun; Datasheet Link: https://componentsearchengine.com/Datasheets/1/PRT-14017.pdf; Height: 13.75mm; Manufacturer_Part_Number: PRT-14017; Mouser Part Number: 474-PRT-14017; Mouser Price/Stock: https://www.mouser.co.uk/ProductDetail/SparkFun/PRT-14017?qs=a4BXICGgSn%2F%252BaML822b65A%3D%3D; Arrow Part Number: PRT-14017; Arrow Price/Stock: https://www.arrow.com/en/products/prt-14017/sparkfun-electronics?region=nac

## Sheet Motor_Connectors.SchDoc
size A4; SheetNumber: 5; SheetTotal: 6
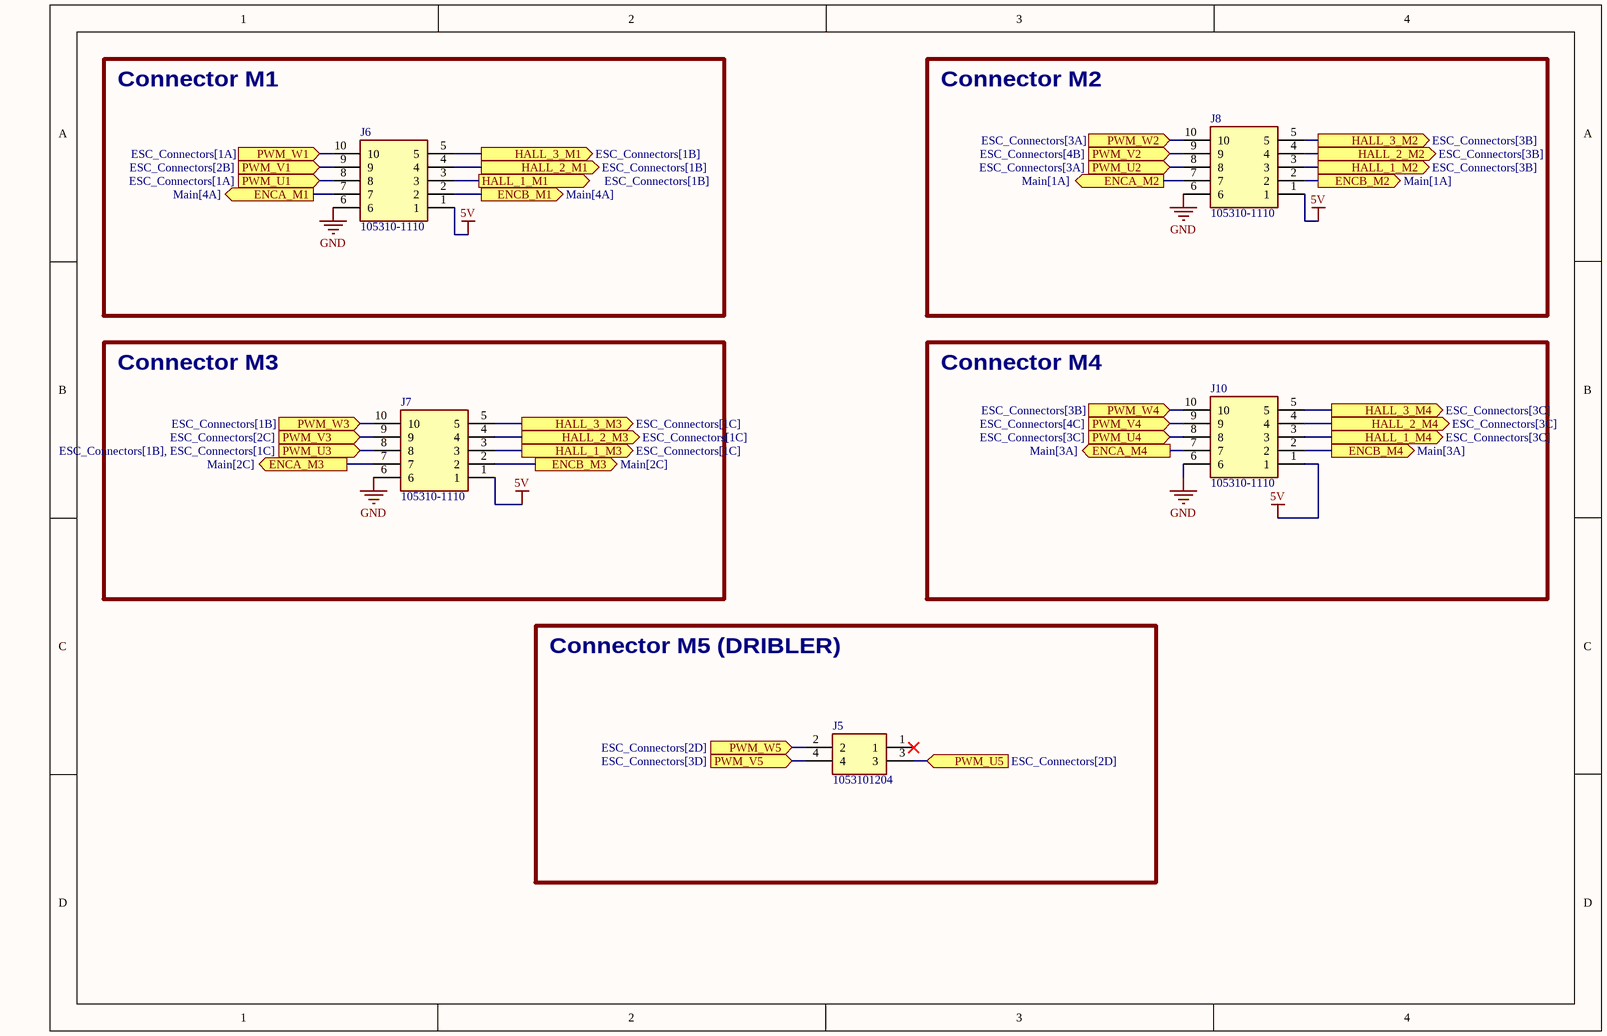
[diagram p4: Motor_Connectors.SchDoc]

### Parts
J5  1053101204  [105310YY04_3]
J6  105310-1110  [1053101110]
J7  105310-1110  [1053101110]
J8  105310-1110  [1053101110]
J10  105310-1110  [1053101110]

### Blocks framed on the sheet
Connector M1: J6
Connector M2: J8
Connector M3: J7
Connector M4: J10
Connector M5 (DRIBLER): J5

### Ports
ENCA_M1 (out, see Main[4A]), ENCA_M2 (out, see Main[1A]), ENCA_M3 (out, see Main[2C]), ENCA_M4 (out, see Main[3A]), ENCB_M1 (out, see Main[4A]), ENCB_M2 (out, see Main[1A]), ENCB_M3 (out, see Main[2C]), ENCB_M4 (out, see Main[3A]), HALL_1_M1 (out, see ESC_Connectors[1B]), HALL_1_M2 (out, see ESC_Connectors[3B]), HALL_1_M3 (out, see ESC_Connectors[1C]), HALL_1_M4 (out, see ESC_Connectors[3C]), HALL_2_M1 (out, see ESC_Connectors[1B]), HALL_2_M2 (out, see ESC_Connectors[3B]), HALL_2_M3 (out, see ESC_Connectors[1C]), HALL_2_M4 (out, see ESC_Connectors[3C]), HALL_3_M1 (out, see ESC_Connectors[1B]), HALL_3_M2 (out, see ESC_Connectors[3B]), HALL_3_M3 (out, see ESC_Connectors[1C]), HALL_3_M4 (out, see ESC_Connectors[3C]), PWM_U1 (in, see ESC_Connectors[1A]), PWM_U2 (in, see ESC_Connectors[3A]), PWM_U3 (in, see ESC_Connectors[1B], ESC_Connectors[1C]), PWM_U4 (in, see ESC_Connectors[3C]), PWM_U5 (in, see ESC_Connectors[2D]), PWM_V1 (in, see ESC_Connectors[2B]), PWM_V2 (in, see ESC_Connectors[4B]), PWM_V3 (in, see ESC_Connectors[2C]), PWM_V4 (in, see ESC_Connectors[4C]), PWM_V5 (in, see ESC_Connectors[3D]), PWM_W1 (in, see ESC_Connectors[1A]), PWM_W2 (in, see ESC_Connectors[3A]), PWM_W3 (in, see ESC_Connectors[1B]), PWM_W4 (in, see ESC_Connectors[3B]), PWM_W5 (in, see ESC_Connectors[2D])

### Nets
5V: J6.1 J7.1 J8.1 J10.1
GND: J6.6 J7.6 J8.6 J10.6
NetJ5_2: J5.2 ; port PWM_W5
NetJ5_3: J5.3 ; port PWM_U5
NetJ5_4: J5.4 ; port PWM_V5
NetJ6_2: J6.2 ; port ENCB_M1
NetJ6_3: J6.3 ; port HALL_1_M1
NetJ6_4: J6.4 ; port HALL_2_M1
NetJ6_5: J6.5 ; port HALL_3_M1
NetJ6_7: J6.7 ; port ENCA_M1
NetJ6_8: J6.8 ; port PWM_U1
NetJ6_9: J6.9 ; port PWM_V1
NetJ6_10: J6.10 ; port PWM_W1
NetJ7_2: J7.2 ; port ENCB_M3
NetJ7_3: J7.3 ; port HALL_1_M3
NetJ7_4: J7.4 ; port HALL_2_M3
NetJ7_5: J7.5 ; port HALL_3_M3
NetJ7_7: J7.7 ; port ENCA_M3
NetJ7_8: J7.8 ; port PWM_U3
NetJ7_9: J7.9 ; port PWM_V3
NetJ7_10: J7.10 ; port PWM_W3
NetJ8_2: J8.2 ; port ENCB_M2
NetJ8_3: J8.3 ; port HALL_1_M2
NetJ8_4: J8.4 ; port HALL_2_M2
NetJ8_5: J8.5 ; port HALL_3_M2
NetJ8_7: J8.7 ; port ENCA_M2
NetJ8_8: J8.8 ; port PWM_U2
NetJ8_9: J8.9 ; port PWM_V2
NetJ8_10: J8.10 ; port PWM_W2
NetJ10_2: J10.2 ; port ENCB_M4
NetJ10_3: J10.3 ; port HALL_1_M4
NetJ10_4: J10.4 ; port HALL_2_M4
NetJ10_5: J10.5 ; port HALL_3_M4
NetJ10_7: J10.7 ; port ENCA_M4
NetJ10_8: J10.8 ; port PWM_U4
NetJ10_9: J10.9 ; port PWM_V4
NetJ10_10: J10.10 ; port PWM_W4

Not connected (* = marked no-connect by the designer): J5 1*

### Library data of the parts
J5 = 1053101204: Connector; Manufacturer_Name: Molex; Datasheet Link: https://www.molex.com/pdm_docs/sd/1053101204_sd.pdf; Height: 10.51mm; Manufacturer_Part_Number: 1053101204; Arrow Part Number: 1053101204; Arrow Price/Stock: https://www.arrow.com/en/products/1053101204/molex?region=nac
J6-J8 J10 = 105310-1110: Connector; Manufacturer_Name: Molex; Datasheet Link: https://www.molex.com/pdm_docs/sd/1053101110_sd.pdf?webSyncID=090114e7-ea8e-9787-c070-e8582bec0296&sessionGUID=771b0990-7150-0e04-30ce-34353ccdcb30; Height: 10.51mm; Manufacturer_Part_Number: 105310-1110; Mouser Part Number: 538-105310-1110; Mouser Price/Stock: https://www.mouser.co.uk/ProductDetail/Molex/105310-1110?qs=PqFvFmEiOr6xTZJaWkdhvQ%3D%3D

## Sheet ESC_Connectors.SchDoc
size A4; SheetNumber: 6; SheetTotal: 6
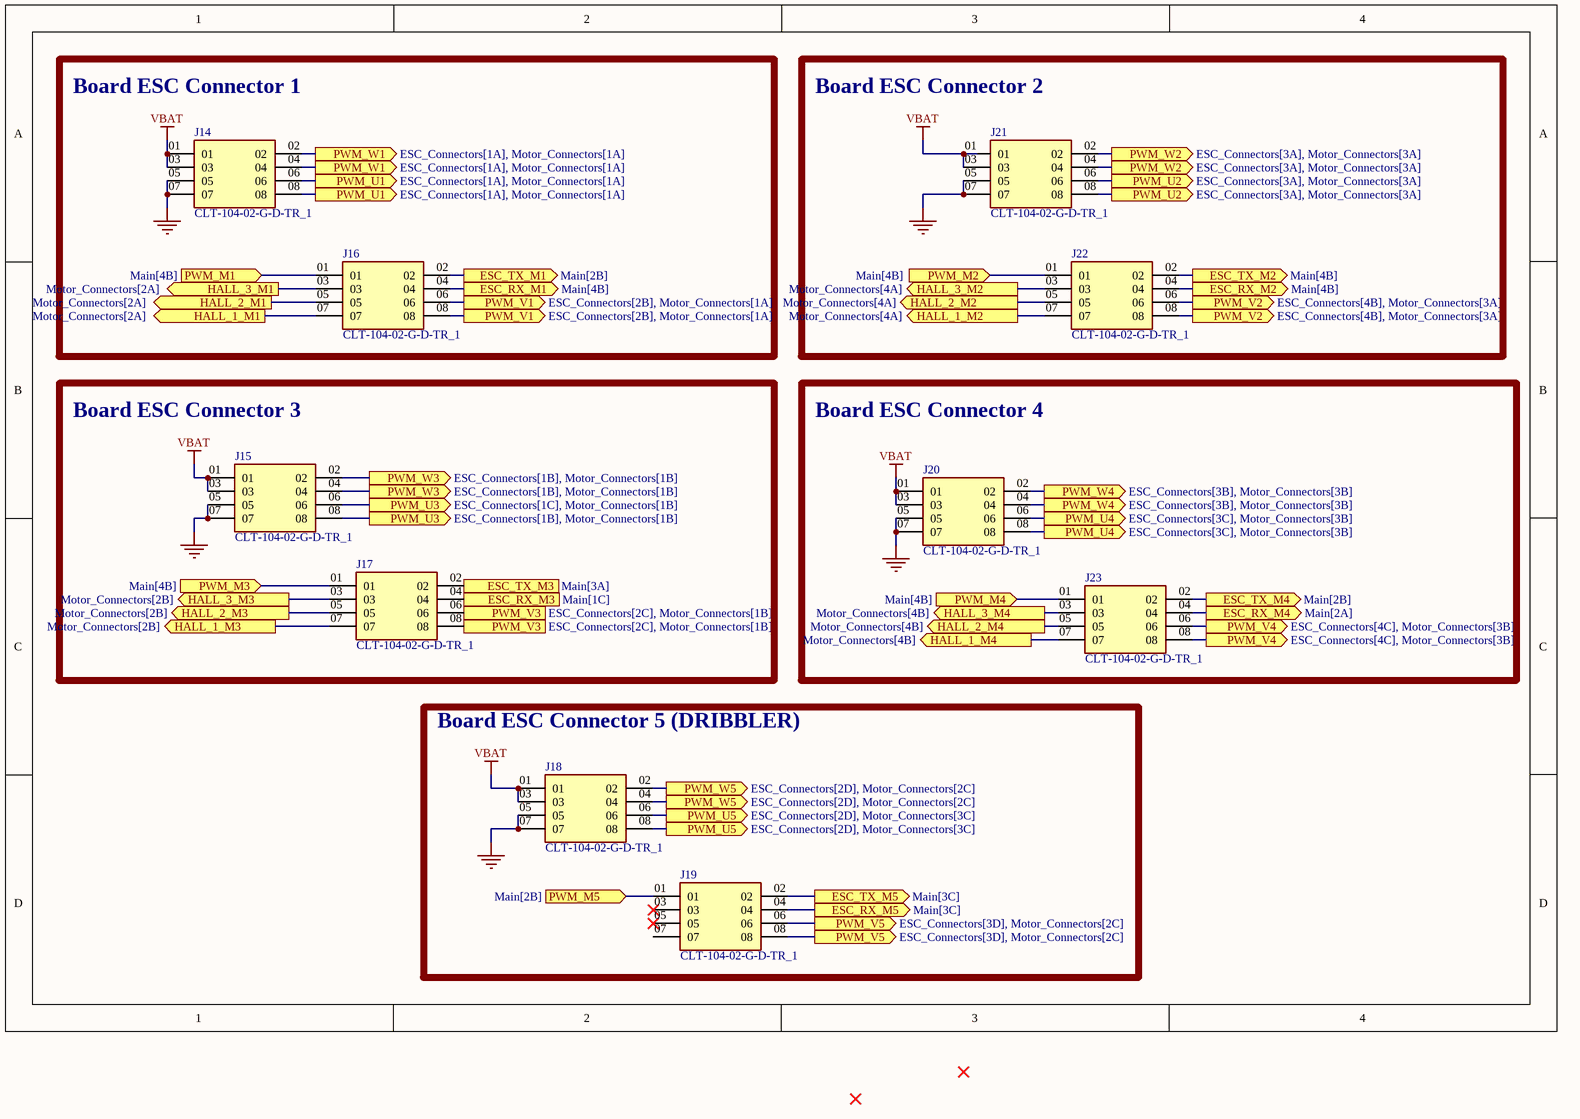
[diagram p5: ESC_Connectors.SchDoc]

### Parts
J14  CLT-104-02-G-D-TR_1  [CLT-104-02-G-D-TR]
J15  CLT-104-02-G-D-TR_1  [CLT-104-02-G-D-TR]
J16  CLT-104-02-G-D-TR_1  [CLT-104-02-G-D-TR]
J17  CLT-104-02-G-D-TR_1  [CLT-104-02-G-D-TR]
J18  CLT-104-02-G-D-TR_1  [CLT-104-02-G-D-TR]
J19  CLT-104-02-G-D-TR_1  [CLT-104-02-G-D-TR]
J20  CLT-104-02-G-D-TR_1  [CLT-104-02-G-D-TR]
J21  CLT-104-02-G-D-TR_1  [CLT-104-02-G-D-TR]
J22  CLT-104-02-G-D-TR_1  [CLT-104-02-G-D-TR]
J23  CLT-104-02-G-D-TR_1  [CLT-104-02-G-D-TR]

### Blocks framed on the sheet
Board ESC Connector 1: J14 J16
Board ESC Connector 2: J21 J22
Board ESC Connector 3: J15 J17
Board ESC Connector 4: J20 J23
Board ESC Connector 5 (DRIBBLER): J18 J19

### Ports
ESC_RX_M1 (out, see Main[4B]), ESC_RX_M2 (out, see Main[4B]), ESC_RX_M3 (out, see Main[1C]), ESC_RX_M4 (out, see Main[2A]), ESC_RX_M5 (out, see Main[3C]), ESC_TX_M1 (out, see Main[2B]), ESC_TX_M2 (out, see Main[4B]), ESC_TX_M3 (out, see Main[3A]), ESC_TX_M4 (out, see Main[2B]), ESC_TX_M5 (out, see Main[3C]), HALL_1_M1 (out, see Motor_Connectors[2A]), HALL_1_M2 (out, see Motor_Connectors[4A]), HALL_1_M3 (out, see Motor_Connectors[2B]), HALL_1_M4 (out, see Motor_Connectors[4B]), HALL_2_M1 (out, see Motor_Connectors[2A]), HALL_2_M2 (out, see Motor_Connectors[4A]), HALL_2_M3 (out, see Motor_Connectors[2B]), HALL_2_M4 (out, see Motor_Connectors[4B]), HALL_3_M1 (out, see Motor_Connectors[2A]), HALL_3_M2 (out, see Motor_Connectors[4A]), HALL_3_M3 (out, see Motor_Connectors[2B]), HALL_3_M4 (out, see Motor_Connectors[4B]), PWM_M1 (in, see Main[4B]), PWM_M2 (in, see Main[4B]), PWM_M3 (in, see Main[4B]), PWM_M4 (in, see Main[4B]), PWM_M5 (in, see Main[2B]), PWM_U1 (out, see ESC_Connectors[1A], Motor_Connectors[1A]), PWM_U2 (out, see ESC_Connectors[3A], Motor_Connectors[3A]), PWM_U3 (out, see ESC_Connectors[1B], Motor_Connectors[1B]), PWM_U3 (out, see ESC_Connectors[1C], Motor_Connectors[1B]), PWM_U4 (out, see ESC_Connectors[3C], Motor_Connectors[3B]), PWM_U5 (out, see ESC_Connectors[2D], Motor_Connectors[3C]), PWM_V1 (out, see ESC_Connectors[2B], Motor_Connectors[1A]), PWM_V2 (out, see ESC_Connectors[4B], Motor_Connectors[3A]), PWM_V3 (out, see ESC_Connectors[2C], Motor_Connectors[1B]), PWM_V4 (out, see ESC_Connectors[4C], Motor_Connectors[3B]), PWM_V5 (out, see ESC_Connectors[3D], Motor_Connectors[2C]), PWM_W1 (out, see ESC_Connectors[1A], Motor_Connectors[1A]), PWM_W2 (out, see ESC_Connectors[3A], Motor_Connectors[3A]), PWM_W3 (out, see ESC_Connectors[1B], Motor_Connectors[1B]), PWM_W4 (out, see ESC_Connectors[3B], Motor_Connectors[3B]), PWM_W5 (out, see ESC_Connectors[2D], Motor_Connectors[2C])

### Nets
GND: J14.05 J14.07 J15.05 J15.07 J18.05 J18.07 J20.05 J20.07 J21.05 J21.07
VBAT: J14.01 J14.03 J15.01 J15.03 J18.01 J18.03 J20.01 J20.03 J21.01 J21.03
NetJ5_2: J18.02 J18.04 ; port PWM_W5
NetJ5_3: J18.06 J18.08 ; port PWM_U5
NetJ5_4: J19.06 J19.08 ; port PWM_V5
NetJ6_3: J16.07 ; port HALL_1_M1
NetJ6_4: J16.05 ; port HALL_2_M1
NetJ6_5: J16.03 ; port HALL_3_M1
NetJ6_8: J14.06 J14.08 ; port PWM_U1
NetJ6_9: J16.06 J16.08 ; port PWM_V1
NetJ6_10: J14.02 J14.04 ; port PWM_W1
NetJ7_3: J17.07 ; port HALL_1_M3
NetJ7_4: J17.05 ; port HALL_2_M3
NetJ7_5: J17.03 ; port HALL_3_M3
NetJ7_8: J15.06 J15.08 ; port PWM_U3
NetJ7_9: J17.06 J17.08 ; port PWM_V3
NetJ7_10: J15.02 J15.04 ; port PWM_W3
NetJ8_3: J22.07 ; port HALL_1_M2
NetJ8_4: J22.05 ; port HALL_2_M2
NetJ8_5: J22.03 ; port HALL_3_M2
NetJ8_8: J21.06 J21.08 ; port PWM_U2
NetJ8_9: J22.06 J22.08 ; port PWM_V2
NetJ8_10: J21.02 J21.04 ; port PWM_W2
NetJ10_3: J23.07 ; port HALL_1_M4
NetJ10_4: J23.05 ; port HALL_2_M4
NetJ10_5: J23.03 ; port HALL_3_M4
NetJ10_8: J20.06 J20.08 ; port PWM_U4
NetJ10_9: J23.06 J23.08 ; port PWM_V4
NetJ10_10: J20.02 J20.04 ; port PWM_W4
NetJ16_01: J16.01 ; port PWM_M1
NetJ16_02: J16.02 ; port ESC_TX_M1
NetJ16_04: J16.04 ; port ESC_RX_M1
NetJ17_01: J17.01 ; port PWM_M3
NetJ17_02: J17.02 ; port ESC_TX_M3
NetJ17_04: J17.04 ; port ESC_RX_M3
NetJ19_01: J19.01 ; port PWM_M5
NetJ19_02: J19.02 ; port ESC_TX_M5
NetJ19_04: J19.04 ; port ESC_RX_M5
NetJ22_01: J22.01 ; port PWM_M2
NetJ22_02: J22.02 ; port ESC_TX_M2
NetJ22_04: J22.04 ; port ESC_RX_M2
NetJ23_01: J23.01 ; port PWM_M4
NetJ23_02: J23.02 ; port ESC_TX_M4
NetJ23_04: J23.04 ; port ESC_RX_M4

Not connected (* = marked no-connect by the designer): J19 03* 05* 07

### Library data of the parts
J14-J23 = CLT-104-02-G-D-TR_1: 8 Position Receptacle Connector 0.079 (2.00mm) Surface Mount Gold; MF: Samtec; SnapEDA_Link: https://www.snapeda.com/parts/CLT-104-02-G-D-TR/Samtec/view-part/?ref=snap; Package: None; Value: *; MP: CLT-104-02-G-D-TR; Check_prices: https://www.snapeda.com/parts/CLT-104-02-G-D-TR/Samtec/view-part/?ref=eda

## Nets that join several sheets
3V3: Main (R19.1 U1.CN11_5 U1.CN11_16), PowerSupply (C4.1 C5.1 L1.2 R4.2), Peripherals (23 pins)
5V: PowerSupply (C9.2 C10.2 L2.2 R6.2), Raspberry (J4.38 J4.40), Motor_Connectors (J6.1 J7.1 J8.1 J10.1)
GND: Main (16 pins), PowerSupply (14 pins), Peripherals (32 pins), Raspberry (5 pins), Motor_Connectors (J6.6 J7.6 J8.6 J10.6), ESC_Connectors (10 pins)
VBAT: Main (J1.1 J1.2 R18.2), PowerSupply (7 pins), ESC_Connectors (10 pins)
NetIC3_4: Main (U1.CN12_5), Peripherals (IC3.4)
NetIC3_13: Main (U1.CN12_17), Peripherals (IC3.13 R16.1)
NetIC3_14: Main (U1.CN11_21), Peripherals (IC3.14 R15.2)
NetIC4_1: Main (U1.CN12_2), Peripherals (IC4.1 R17.2)
NetIC4_2: Main (U1.CN12_23), Peripherals (IC4.2)
NetIC4_4: Main (U1.CN12_1), Peripherals (IC4.4)
NetJ2_2: Main (U1.CN11_54), Peripherals (J2.2 R9.2)
NetJ4_32: Main (U1.CN11_2), Raspberry (J4.32)
NetJ4_34: Main (U1.CN11_1), Raspberry (J4.34)
NetJ5_2: Motor_Connectors (J5.2), ESC_Connectors (J18.02 J18.04)
NetJ5_3: Motor_Connectors (J5.3), ESC_Connectors (J18.06 J18.08)
NetJ5_4: Motor_Connectors (J5.4), ESC_Connectors (J19.06 J19.08)
NetJ6_2: Main (U1.CN12_41), Motor_Connectors (J6.2)
NetJ6_3: Motor_Connectors (J6.3), ESC_Connectors (J16.07)
NetJ6_4: Motor_Connectors (J6.4), ESC_Connectors (J16.05)
NetJ6_5: Motor_Connectors (J6.5), ESC_Connectors (J16.03)
NetJ6_7: Main (U1.CN12_43), Motor_Connectors (J6.7)
NetJ6_8: Motor_Connectors (J6.8), ESC_Connectors (J14.06 J14.08)
NetJ6_9: Motor_Connectors (J6.9), ESC_Connectors (J16.06 J16.08)
NetJ6_10: Motor_Connectors (J6.10), ESC_Connectors (J14.02 J14.04)
NetJ7_2: Main (U1.CN11_70), Motor_Connectors (J7.2)
NetJ7_3: Motor_Connectors (J7.3), ESC_Connectors (J17.07)
NetJ7_4: Motor_Connectors (J7.4), ESC_Connectors (J17.05)
NetJ7_5: Motor_Connectors (J7.5), ESC_Connectors (J17.03)
NetJ7_7: Main (U1.CN11_65), Motor_Connectors (J7.7)
NetJ7_8: Motor_Connectors (J7.8), ESC_Connectors (J15.06 J15.08)
NetJ7_9: Motor_Connectors (J7.9), ESC_Connectors (J17.06 J17.08)
NetJ7_10: Motor_Connectors (J7.10), ESC_Connectors (J15.02 J15.04)
NetJ8_2: Main (U1.CN11_30), Motor_Connectors (J8.2)
NetJ8_3: Motor_Connectors (J8.3), ESC_Connectors (J22.07)
NetJ8_4: Motor_Connectors (J8.4), ESC_Connectors (J22.05)
NetJ8_5: Motor_Connectors (J8.5), ESC_Connectors (J22.03)
NetJ8_7: Main (U1.CN11_28), Motor_Connectors (J8.7)
NetJ8_8: Motor_Connectors (J8.8), ESC_Connectors (J21.06 J21.08)
NetJ8_9: Motor_Connectors (J8.9), ESC_Connectors (J22.06 J22.08)
NetJ8_10: Motor_Connectors (J8.10), ESC_Connectors (J21.02 J21.04)
NetJ10_2: Main (U1.CN12_15), Motor_Connectors (J10.2)
NetJ10_3: Motor_Connectors (J10.3), ESC_Connectors (J23.07)
NetJ10_4: Motor_Connectors (J10.4), ESC_Connectors (J23.05)
NetJ10_5: Motor_Connectors (J10.5), ESC_Connectors (J23.03)
NetJ10_7: Main (U1.CN12_13), Motor_Connectors (J10.7)
NetJ10_8: Motor_Connectors (J10.8), ESC_Connectors (J20.06 J20.08)
NetJ10_9: Motor_Connectors (J10.9), ESC_Connectors (J23.06 J23.08)
NetJ10_10: Motor_Connectors (J10.10), ESC_Connectors (J20.02 J20.04)
NetJ16_01: Main (U1.CN12_52), ESC_Connectors (J16.01)
NetJ16_02: Main (U1.CN11_9), ESC_Connectors (J16.02)
NetJ16_04: Main (U1.CN11_11), ESC_Connectors (J16.04)
NetJ17_01: Main (U1.CN12_47), ESC_Connectors (J17.01)
NetJ17_02: Main (U1.CN11_41), ESC_Connectors (J17.02)
NetJ17_04: Main (U1.CN11_43), ESC_Connectors (J17.04)
NetJ19_01: Main (U1.CN12_3), ESC_Connectors (J19.01)
NetJ19_02: Main (U1.CN12_4), ESC_Connectors (J19.02)
NetJ19_04: Main (U1.CN12_19), ESC_Connectors (J19.04)
NetJ22_01: Main (U1.CN12_56), ESC_Connectors (J22.01)
NetJ22_02: Main (U1.CN12_48), ESC_Connectors (J22.02)
NetJ22_04: Main (U1.CN12_46), ESC_Connectors (J22.04)
NetJ23_01: Main (U1.CN11_50), ESC_Connectors (J23.01)
NetJ23_02: Main (U1.CN11_47), ESC_Connectors (J23.02)
NetJ23_04: Main (U1.CN11_46), ESC_Connectors (J23.04)
NetMD1_3: Main (U1.CN11_35), Peripherals (MD1.3)
NetMD1_4: Main (U1.CN11_37), Peripherals (MD1.4)
NetMD1_5: Main (U1.CN11_40), Peripherals (MD1.5)
NetMD1_6: Main (U1.CN12_16), Peripherals (MD1.6)
NetMD1_8: Main (U1.CN12_69), Peripherals (MD1.8)
NetMD1_9: Main (U1.CN12_68), Peripherals (MD1.9)
NetMD1_11: Main (U1.CN11_17), Peripherals (MD1.11)
NetMD1_12: Main (U1.CN11_4), Peripherals (MD1.12)
NetMD1_13: Main (U1.CN12_59), Peripherals (MD1.13)
NetMD2_3: Main (U1.CN11_63), Peripherals (MD2.3)
NetMD2_4: Main (U1.CN12_29), Peripherals (MD2.4)
NetMD2_5: Main (U1.CN12_11), Peripherals (MD2.5)
NetMD2_6: Main (U1.CN11_32), Peripherals (MD2.6)
NetMD2_11: Main (U1.CN12_22), Peripherals (MD2.11)
NetMD2_12: Main (U1.CN12_27), Peripherals (MD2.12)
NetMD2_13: Main (U1.CN12_24), Peripherals (MD2.13)
NetP1_3: Main (U1.CN11_51), Peripherals (P1.3 R11.1)
NetP1_4: Main (U1.CN11_53), Peripherals (P1.4 R8.1)
NetR10_1: Main (U1.CN12_37), Peripherals (R10.1)
NetR21_2: Main (U1.CN11_42), Peripherals (R21.2)
NetR22_2: Main (U1.CN11_59), Peripherals (R22.2)
NetR23_2: Main (U1.CN11_58), Peripherals (R23.2)